# EAGLE design p2p-001 (EAGLE 9.6.2)
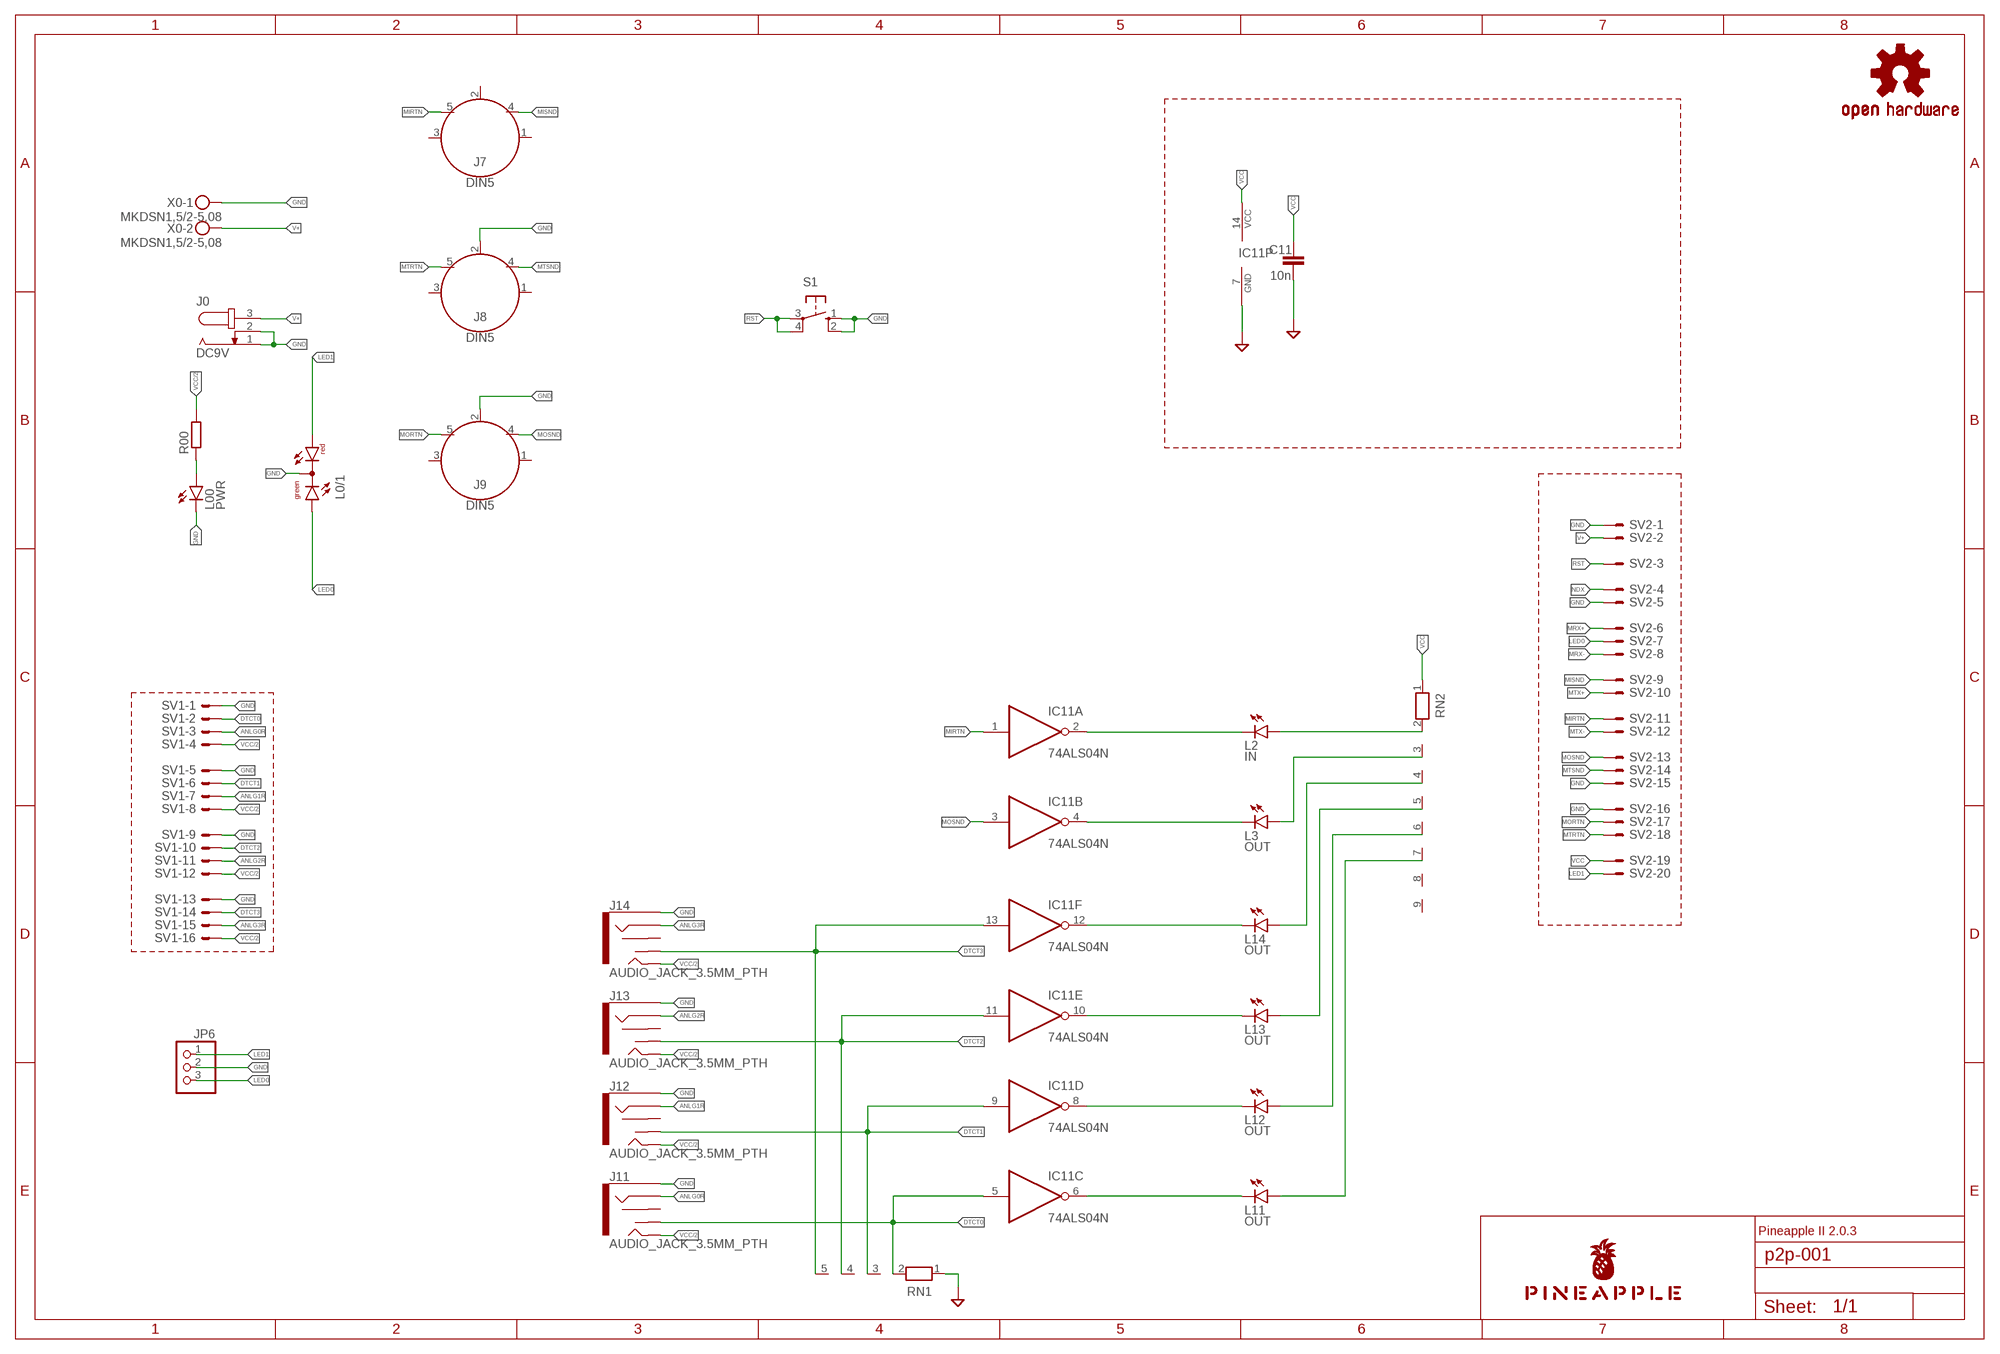
[diagram p0: schematic, sheet 1]

## Parts
C11  10n  C-EU025-024X044  [C025-024X044]
IC11  74ALS04N  [DIL14]
J0  DC9V  JACK-PLUG0  [SPC4077]
J7  DIN5  [DIN5-RA-PTH]
J8  DIN5  [DIN5-RA-PTH]
J9  DIN5  [DIN5-RA-PTH]
J11  AUDIO_JACK_3.5MM_PTH  [AUDIO-JACK]
J12  AUDIO_JACK_3.5MM_PTH  [AUDIO-JACK]
J13  AUDIO_JACK_3.5MM_PTH  [AUDIO-JACK]
J14  AUDIO_JACK_3.5MM_PTH  [AUDIO-JACK]
JP6  PINHD-1X3  [1X03]
L00  PWR  LED3MM  [LED3MM]
L0/1  DUOLED-RG-C  [DUOLED-C-5MM]
L2  IN  LED3MM  [LED3MM]
L3  OUT  LED3MM  [LED3MM]
L11  OUT  LED3MM  [LED3MM]
L12  OUT  LED3MM  [LED3MM]
L13  OUT  LED3MM  [LED3MM]
L14  OUT  LED3MM  [LED3MM]
LOGO1  OSHW-LOGOS-COPPER  [OSHW-LOGO-S_COPPER]
R00  R-EU_0204/5  [0204/5]
RN1  RN04  [RN-5]
RN2  RN08  [RN-9]
S1  10-XX  [B3F-10XX]
SV1  ML16LE  [ML16L]
SV2  ML20LE  [ML20L]
U$1  PINEAPPLE450_SILK  [PINEAPPLE450_SILK]
X0  MKDSN1,5/2-5,08  [MKDSN1,5/2-5,08]

## Nets
ANLG0R: J11.RING SV1.3
ANLG1R: J12.RING SV1.7
ANLG2R: J13.RING SV1.11
ANLG3R: J14.RING SV1.15
DTCT0: IC11.5(C:I) J11.TSH RN1.2 SV1.2
DTCT1: IC11.9(D:I) J12.TSH RN1.3 SV1.6
DTCT2: IC11.11(E:I) J13.TSH RN1.4 SV1.10
DTCT3: IC11.13(F:I) J14.TSH RN1.5 SV1.14
GND [gnd]: C11.2 IC11.7(P:GND) J0.1 J0.2 J8.2 J9.2 J11.SLEEVE J12.SLEEVE J13.SLEEVE J14.SLEEVE JP6.2 L00.K(C) L0/1.C RN1.1 S1.1(S) S1.2(S1) SV1.1 SV1.5 SV1.9 SV1.13 SV2.1 SV2.5 SV2.15 SV2.16 X0.1
LED0: JP6.3 L0/1.AX(AG) SV2.7
LED1: JP6.1 L0/1.AR SV2.20
LEDPWR: L00.A R00.1
MIRTN: IC11.1(A:I) J7.5 SV2.11
MISND: J7.4 SV2.9
MORTN: J9.5 SV2.17
MOSND: IC11.3(B:I) J9.4 SV2.13
MRX+: SV2.6
MRX-: SV2.8
MTRTN: J8.5 SV2.18
MTSND: J8.4 SV2.14
MTX+ [gnd]: SV2.10
MTX-: SV2.12
N$1: IC11.2(A:O) L2.K(C)
N$2: IC11.4(B:O) L3.K(C)
N$3: L2.A RN2.2
N$4: L3.A RN2.3
N$5: L14.A RN2.4
N$6: L13.A RN2.5
N$7: IC11.12(F:O) L14.K(C)
N$8: IC11.10(E:O) L13.K(C)
N$9: IC11.8(D:O) L12.K(C)
N$10: IC11.6(C:O) L11.K(C)
N$12: L12.A RN2.6
N$13: L11.A RN2.7
NDX: SV2.4
RST: S1.3(P) S1.4(P1) SV2.3
V+ [power]: J0.3 SV2.2 X0.2
VCC [power]: C11.1 IC11.14(P:VCC) RN2.1 SV2.19
VCC/2 [power]: J11.TIP J12.TIP J13.TIP J14.TIP R00.2 SV1.4 SV1.8 SV1.12 SV1.16
Unconnected: J7.1 J7.2 J7.3 J8.1 J8.3 J9.1 J9.3 J11.RSH J12.RSH J13.RSH J14.RSH RN2.8 RN2.9

## Notes on the sheet
- Pineapple II 2.0.3

## Library data of the parts
C11 = resistor:C-EU: CAPACITOR, European symbol
IC11 = 74xx-us:74*04: Hex INVERTER
J0 = con-jack:JACK-PLUG: DC POWER JACK Power Jack, DC, Right Angle, Through Hole, Rated 5A at 16VDC, PC Terminals Distributor: Farnell (www.Farnell.de) Drawing: 84N1161.pdf / 84N1162.pdf Manufacturer: SPC Technology (www.spctechnology.com) Type: SPC4077 / SPC 4078; OC_FARNELL: unknown; OC_NEWARK: unknown
J7-J9 = SparkFun-Connectors:DIN5: DIN5 Connector - Female Right Angle (frequently used as a MIDI Jack connector) This type of connector and cable is frequently used for transmitting midi data (musical instrument digital interface). It is what you usually see on a keyboard or set of electronic drums. Learn more here <https://en.wikipedia.org/wiki/MIDI>. For more information on the pinout and electrical specifications of MIDI communications, please see the following resource: https://www.midi.org/specifications/item/midi-din-electrical-specification Here is the connector we sell at SparkFun: MIDI Connector - Female Right Angle <https://www.sparkfun.com/products/9536> (PRT-09536) Datasheet <hhttp://www.sparkfun.com/datasheets/Prototyping/Connectors/MIDI-RA.pdf> It is used on this SparkFun product: SparkFun MIDI Shield <https://www.sparkfun.com/products/12898> (DEV-12898); PROD_ID: CONN-09481
J11-J14 = SparkFun-Connectors:AUDIO_JACK_3.5MM: Audio Jack 3.5mm variants of PTH and SMT stereo audio jack with bypass switches. SparkFun Products: SparkFun SparkPunk Sound Kit <[https://www.sparkfun.com/products/11177]> - PTH MP3 Trigger <https://www.sparkfun.com/products/13720> -3.5mm SMD SparkFun PicoBoard <https://www.sparkfun.com/products/11888>- 2.5mm SMD; PROD_ID: CONN-08774; SF_ID: PRT-08032
JP6 = pinhead:PINHD-1X3: PIN HEADER
L00 L2 L3 L11-L14 = led:LED: LED OSRAM: - CHIPLED LG R971, LG N971, LY N971, LG Q971, LY Q971, LO R971, LY R971 LH N974, LH R974 LS Q976, LO Q976, LY Q976 LO Q996 - Hyper CHIPLED LW Q18S LB Q993, LB Q99A, LB R99A - SideLED LS A670, LO A670, LY A670, LG A670, LP A670 LB A673, LV A673, LT A673, LW A673 LH A674 LY A675 LS A676, LA A676, LO A676, LY A676, LW A676 LS A679, LY A679, LG A679 - Hyper Micro SIDELED® LS Y876, LA Y876, LO Y876, LY Y876 LT Y87S - SmartLED LW L88C, LW L88S LB L89C, LB L89S, LG L890 LS L89K, LO L89K, LY L89K LS L896, LA L896, LO L896, LY L896 - TOPLED LS T670, LO T670, LY T670, LG T670, LP T670 LSG T670, LSP T670, LSY T670, LOP T670, LYG T670 LG T671, LOG T671, LSG T671 LB T673, LV T673, LT T673, LW T673 LH T674 LS T676, LA T676, LO T676, LY T676, LB T676, LH T676, LSB T676, LW T676 LB T67C, LV T67C, LT T67C, LS T67K, LO T67K, LY T67K, LW E67C LS E67B, LA E67B, LO E67B, LY E67B, LB E67C, LV E67C, LT E67C LW T67C LS T679, LY T679, LG T679 LS T770, LO T770, LY T770, LG T770, LP T770 LB T773, LV T773, LT T773, LW T773 LH T774 LS E675, LA E675, LY E675, LS T675 LS T776, LA T776, LO T776, LY T776, LB T776 LHGB T686 LT T68C, LB T68C - Hyper Mini TOPLED® LB M676 - Mini TOPLED Santana® LG M470 LS M47K, LO M47K, LY M47K Source: http://www.osram.convergy.de LUXEON: - LUMILED® LXK2-PW12-R00, LXK2-PW12-S00, LXK2-PW14-U00, LXK2-PW14-V00 LXK2-PM12-R00, LXK2-PM12-S00, LXK2-PM14-U00 LXK2-PE12-Q00, LXK2-PE12-R00, LXK2-PE12-S00, LXK2-PE14-T00, LXK2-PE14-U00 LXK2-PB12-K00, LXK2-PB12-L00, LXK2-PB12-M00, LXK2-PB14-N00, LXK2-PB14-P00, LXK2-PB14-Q00 LXK2-PR12-L00, LXK2-PR12-M00, LXK2-PR14-Q00, LXK2-PR14-R00 LXK2-PD12-Q00, LXK2-PD12-R00, LXK2-PD12-S00 LXK2-PH12-R00, LXK2-PH12-S00 LXK2-PL12-P00, LXK2-PL12-Q00, LXK2-PL12-R00 Source: www.luxeon.com KINGBRIGHT: KA-3528ASYC Source: www.kingbright.com
L0/1 = led:DUOLED-RG-C: DUO LED 2 colors (red/green), 5 mm, round, common Cathode www.ligitek.com or other producers.
LOGO1 = SparkFun-Aesthetics:OSHW-LOGO: Open-Source Hardware (OSHW) Logo This logo indicates the piece of hardware it is found on incorporates a OSHW license and/or adheres to the definition of open source hardware found here: http://freedomdefined.org/OSHW
R00 = rcl:R-EU_: RESISTOR, European symbol; SPICEPREFIX: R
RN1 = resistor-net:RN04: RESISTOR NETWORK; OC_FARNELL: unknown; OC_NEWARK: unknown
RN2 = resistor-net:RN08: RESISTOR NETWORK; OC_FARNELL: unknown; OC_NEWARK: unknown
S1 = switch-omron:10-XX: OMRON SWITCH; MPN: B3F-1000; OC_FARNELL: 176432; OC_NEWARK: 36M3542
SV1 = con-ml:ML16LE: HARTING; OC_FARNELL: unknown; OC_NEWARK: unknown
SV2 = con-ml:ML20LE: HARTING; OC_FARNELL: unknown; OC_NEWARK: unknown
U$1 = pineapple:PINEAPPLE450_SILK
X0 = con-phoenix-508:MKDSN1,5/2-5,08: MKDSN 1,5/ 2-5,08 Printklemme Nennstrom: 13,5 A Nennspannung: 250 V Rastermaß: 5,08 mm Polzahl: 2 Anschlussart: Schraubanschluss Montage: Löten Anschlussrichtung Leiter/Platine: 0 ° Artikelnummer: 1729128 Source: http://eshop.phoenixcontact.com .. 1729128.pdf

## Net classes
0 default: width 0.152 mm, drill 0.152 mm, clearance 0.152 mm
1 gnd: width 0.61 mm, drill 0.152 mm, clearance 0.152 mm
2 power: width 0.61 mm, drill 0.152 mm, clearance 0.152 mm
3 analog: width 0.305 mm, drill 0.152 mm, clearance 0.152 mm

## Board
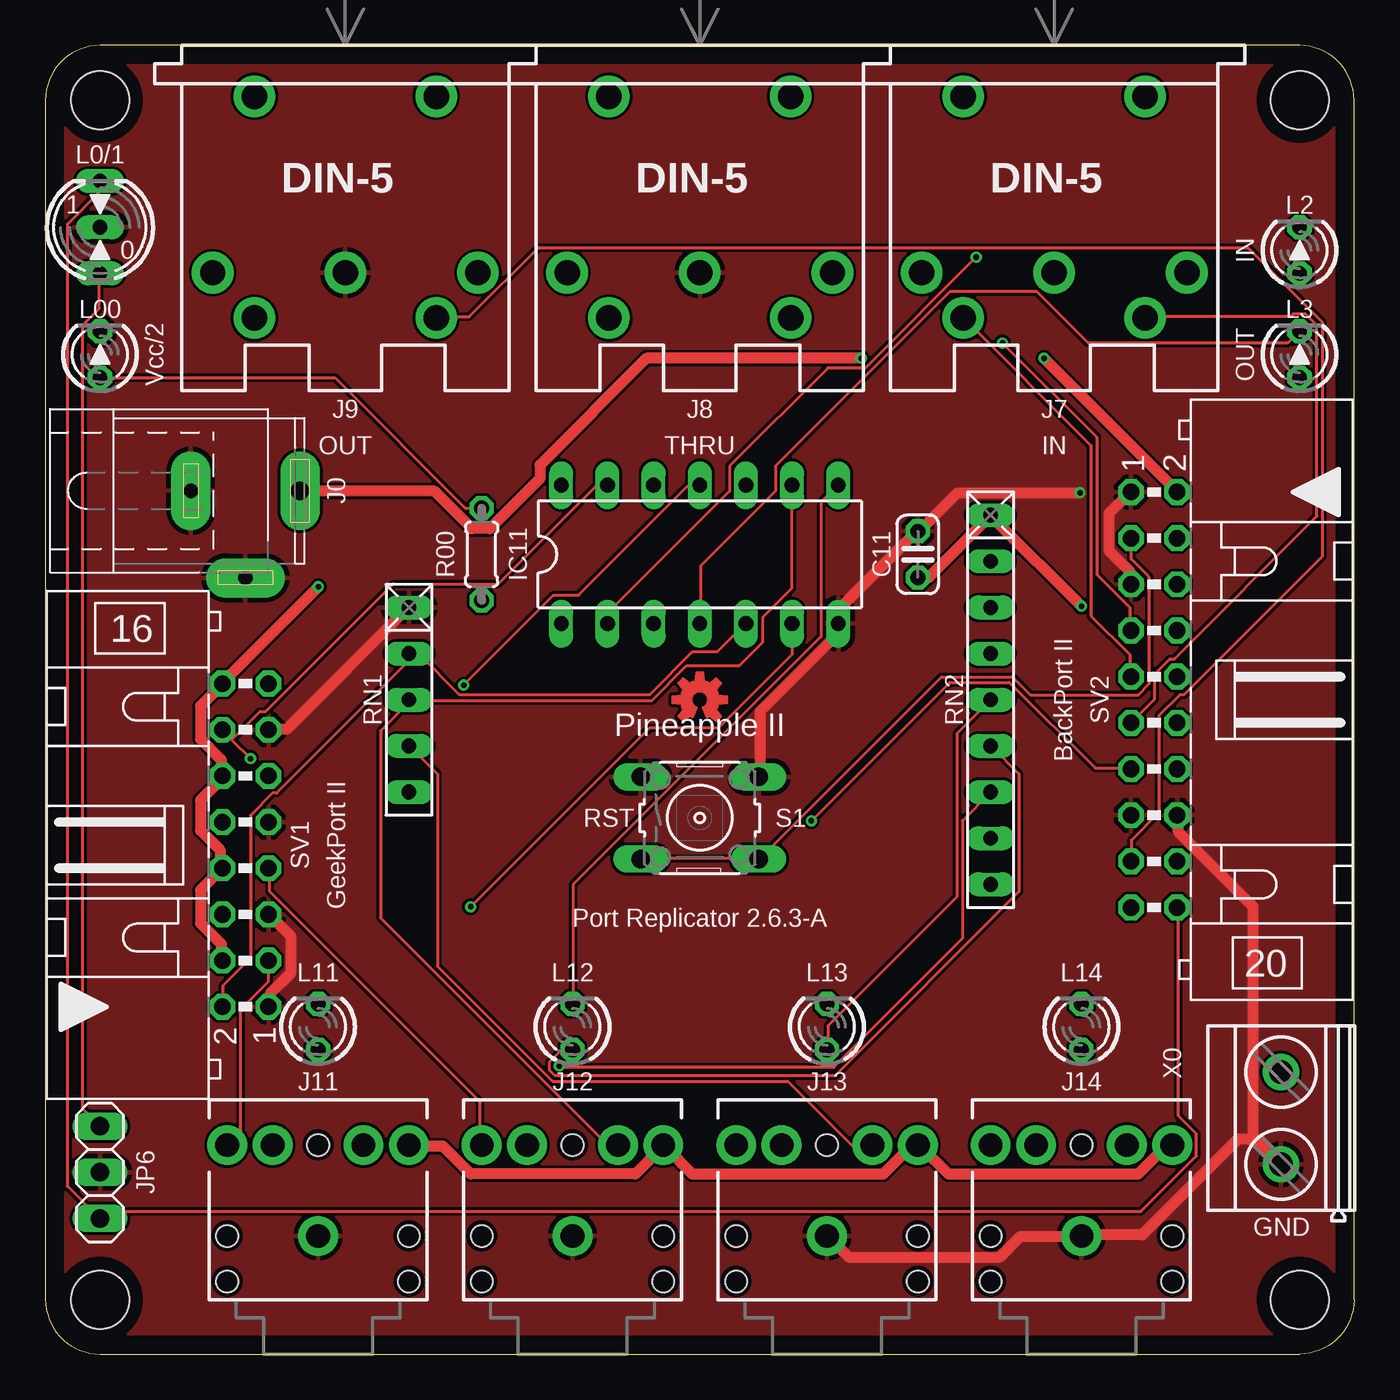
[diagram p1: board, top side]
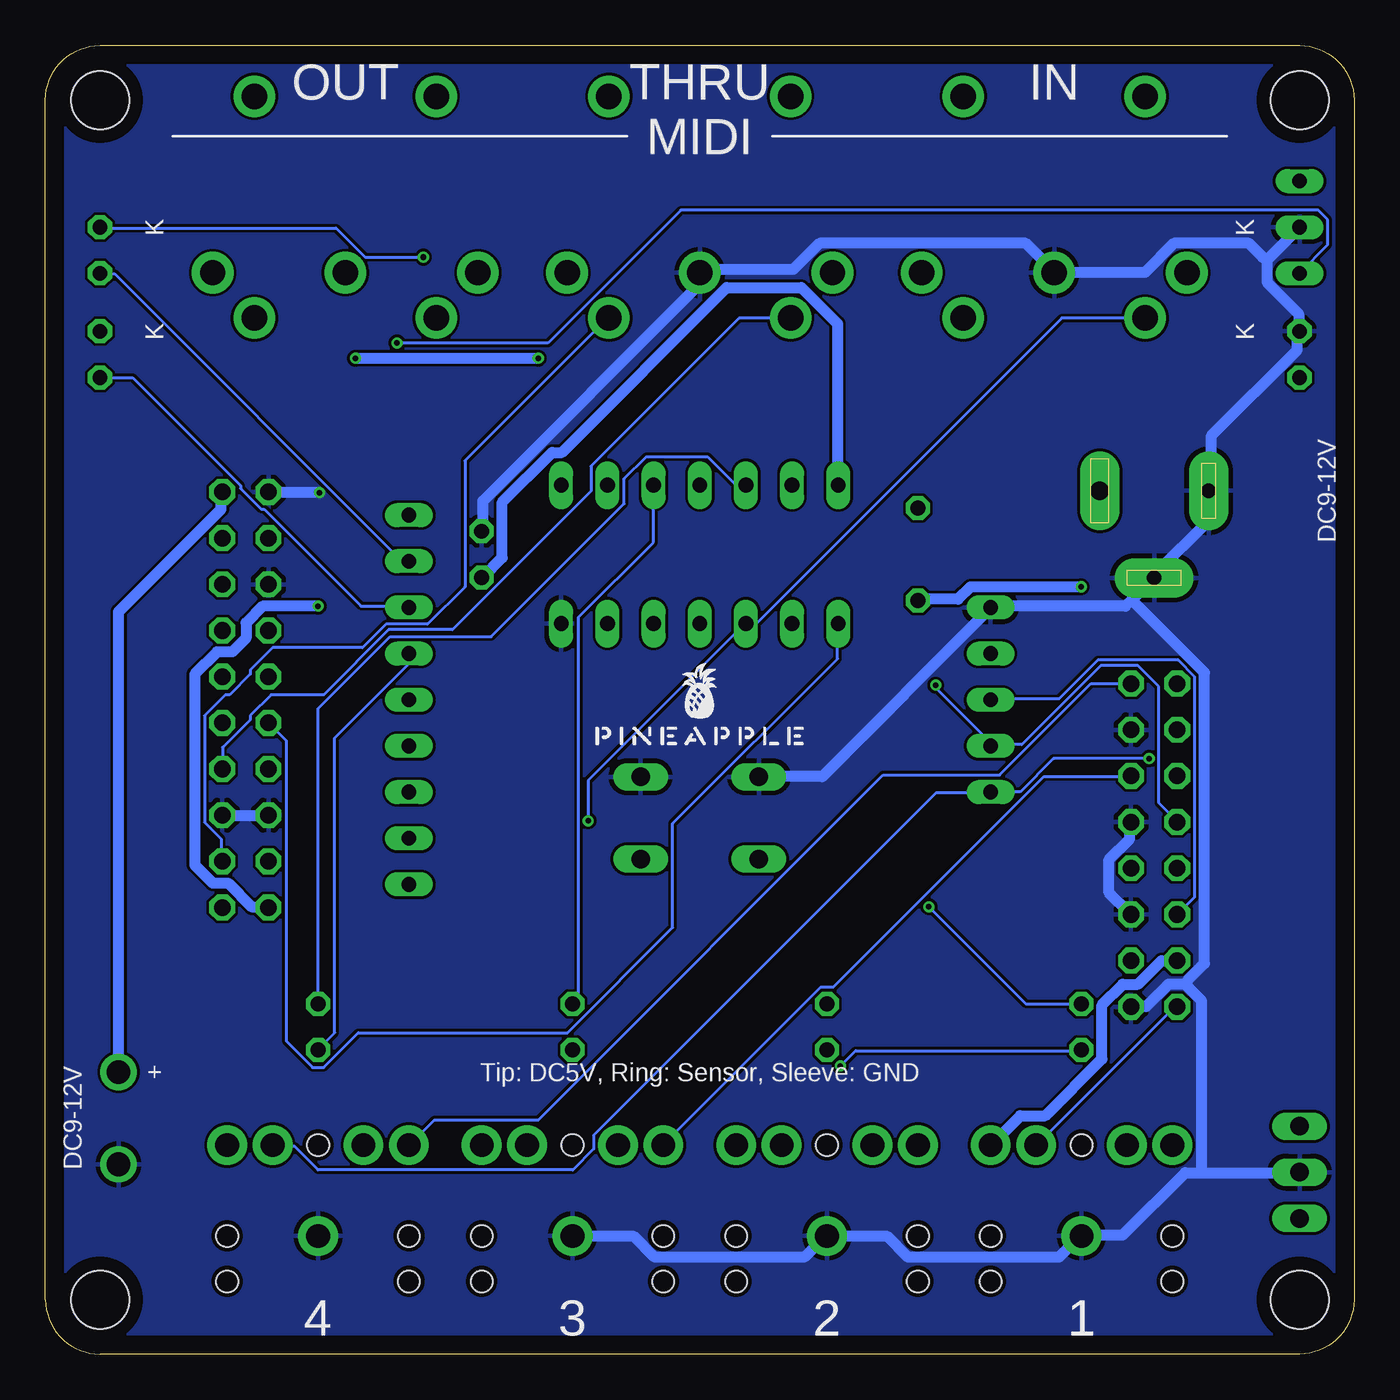
[diagram p2: board, bottom side, seen from below]

Size 72 x 72 mm. Coordinates in mm from the lower left corner, seen from the top.
Outline: 3,0 69,0 arc90 72,3 72,69 arc90 69,72 3,72 arc90 0,69 0,3 arc90 3,0
Copper layers (1*16): Top 0.035mm / dielectric 1.5mm / Bottom 0.035mm
Design rules "SeeedStudio_2layer_DRU_no_angle_20140221": minimum track width 6mil, minimum drill 12mil, track to track 6mil, track to pad 6mil, pad to pad 6mil, via to via 6mil, smd to smd 0mil, copper to edge 10mil, drill to drill 10mil, minimum pad ring 10mil, minimum via ring 6mil, stop-mask expansion 2mil, vias tented up to drill 100mil, thermal gap 10mil
Holes 3.2 mm at 3,3 69,3 69,69 3,69
tRestrict: area 0.8,66.8 to 5.2,71.2; area 66.8,66.8 to 71.2,71.2; area 0.8,0.8 to 5.2,5.2; area 66.8,0.8 to 71.2,5.2; area 0,71 to 72,72; area 0,0 to 72,1; area 0,0 to 1,72; area 71,0 to 72,72
bRestrict: area 0.8,0.8 to 5.2,5.2; area 66.8,0.8 to 71.2,5.2; area 66.8,66.8 to 71.2,71.2; area 0.8,66.8 to 5.2,71.2; area 0,71 to 72,72; area 0,0 to 72,1; area 0,0 to 1,72; area 71,0 to 72,72
vRestrict: area 30,33 to 42,38

### Footprints (pad centres in the part's own frame; a part is rotated, then mirrored left to right if it is on the bottom)
C025-024X044 = drill 0.813 octagon: 1 -1.27,0; 2 1.27,0
DIL14 = drill 0.813 long: 1 -7.62,-3.81; 2 -5.08,-3.81; 3 -2.54,-3.81; 4 0,-3.81; 5 2.54,-3.81; 6 5.08,-3.81; 7 7.62,-3.81; 8 7.62,3.81; 9 5.08,3.81; 10 2.54,3.81; 11 0,3.81; 12 -2.54,3.81; 13 -5.08,3.81; 14 -7.62,3.81
SPC4077 = drill 0.8 pad 2.184 long: 1 -3,0; 2 0,-4.8 | drill 1 pad 2.184 long: 3 3,0
DIN5-RA-PTH = drill 1.4 pad 2.286: 1 7.3,12.5; 2 0,12.5; 3 -7.3,12.5; 4 5,15; 5 -5,15; 6 -5,2.8; 7 5,2.8
AUDIO-JACK = drill 1.3 pad 2.184: RING 5,5; RSH 5,2.5; SLEEVE 0,0; TIP 5,-5; TSH 5,-2.5 | hole 1.2: 0,5; -2.5,5; -2.5,-5; 0,-5; 5,0
1X03 = drill 1.016 long: 1 -2.54,0; 2 0,0; 3 2.54,0
LED3MM = drill 0.813 octagon: A -1.27,0; K 1.27,0
DUOLED-C-5MM = drill 0.813 long: AR 2.54,0; AX -2.54,0; C 0,0
0204/5 = drill 0.813 octagon: 1 -2.54,0; 2 2.54,0
RN-5 = drill 0.813 long: 1 -5.08,0; 2 -2.54,0; 3 0,0; 4 2.54,0; 5 5.08,0
RN-9 = drill 0.813 long: 1 -10.16,0; 2 -7.62,0; 3 -5.08,0; 4 -2.54,0; 5 0,0; 6 2.54,0; 7 5.08,0; 8 7.62,0; 9 10.16,0
B3F-10XX = drill 1.016 long: 1 -3.251,2.261; 2 3.251,2.261; 3 -3.251,-2.261; 4 3.251,-2.261
ML16L = drill 0.914 octagon: 1 -8.89,-1.27; 2 -8.89,1.27; 3 -6.35,-1.27; 4 -6.35,1.27; 5 -3.81,-1.27; 6 -3.81,1.27; 7 -1.27,-1.27; 8 -1.27,1.27; 9 1.27,-1.27; 10 1.27,1.27; 11 3.81,-1.27; 12 3.81,1.27; 13 6.35,-1.27; 14 6.35,1.27; 15 8.89,-1.27; 16 8.89,1.27
ML20L = drill 0.914 octagon: 1 -11.43,-1.27; 2 -11.43,1.27; 3 -8.89,-1.27; 4 -8.89,1.27; 5 -6.35,-1.27; 6 -6.35,1.27; 7 -3.81,-1.27; 8 -3.81,1.27; 9 -1.27,-1.27; 10 -1.27,1.27; 11 1.27,-1.27; 12 1.27,1.27; 13 3.81,-1.27; 14 3.81,1.27; 15 6.35,-1.27; 16 6.35,1.27; 17 8.89,-1.27; 18 8.89,1.27; 19 11.43,-1.27; 20 11.43,1.27
MKDSN1,5/2-5,08 = drill 1.3 pad 2: 1 -2.561,0.025; 2 2.519,0.025

### Placement (x,y rotation side)
C11  48,44 90 top
IC11  36,44 0 top
J0  11,47.5 0 top
J7  55.5,72 180 top
J8  36,72 180 top
J9  16.5,72 180 top
J11  15,6.5 90 top
J12  29,6.5 90 top
J13  43,6.5 90 top
J14  57,6.5 90 top
JP6  3,10 90 top
L00  3,55 90 top
L0/1  3,62 90 top
L2  69,60.73 90 top
L3  69,55 90 top
L11  15,18 90 top
L12  29,18 90 top
L13  43,18 90 top
L14  57,18 90 top
LOGO1  36,36 0 top
R00  24,44 270 top
RN1  20,36 270 top
RN2  52,36 270 top
S1  36,29.5 0 top
SV1  11,28 90 top
SV2  61,36 270 top
U$1  36,33.5 0 bottom
X0  68,13 90 top

### Tracks (layer width: path | path; a pad name or v marks a point on that pad's centre or on a via)
ANLG0R
  Top 0.152: SV1.3 12.27,20.5 10.74,18.97 10.74,12.19 10.06,11.51 J11.RING
ANLG1R
  Top 0.152: SV1.7 12.34,26.67 12.34,25.45 23.93,13.87 23.93,11.51 J12.RING
ANLG2R
  Bottom 0.152: SV1.11 12.34,31.77 17.07,31.77 28.65,20.19 29.34,20.19 38.02,11.51 J13.RING
ANLG3R
  Bottom 0.152: SV1.15 12.34,36.88 14.48,36.88 19.51,31.85 25.91,31.85 44.88,12.88 50.6,12.88 51.97,11.51 J14.RING
DTCT0
  Top 0.152: IC11.5 38.48,40.16 36.96,38.63 35.59,38.63 33.22,36.27 22.78,36.27 20.57,38.48 20.04,38.48 RN1.2 20.04,38.41 20.04,38.18 12.72,30.86 12.5,30.86 11.28,29.64 11.28,21.79 9.75,20.27 9.75,19.13 SV1.2
  Bottom 0.152: SV1.2 9.75,19.05 9.91,19.05 17.45,11.51 J11.TSH
DTCT1
  Top 0.152: IC11.9 41.07,47.78 41.07,42.14 39.47,40.54 39.47,39.17 38.18,37.87 35.28,37.87 33.38,35.97 20.04,35.97 RN1.3 20.04,35.89 18.44,34.29 18.44,24 30.94,11.51 31.47,11.51 J12.TSH
  Bottom 0.152: RN1.3 19.96,36.04 16.23,36.04 14.1,38.18 9.68,38.18 8.76,37.26 8.76,25.15 9.68,24.23 SV1.6
DTCT2  (via drill 0.3)
  Top 0.152: v23.01,36.8 27.96,41.76 29.34,41.76 35.36,47.78 35.97,47.78 IC11.11 | J13.TSH 44.35,11.51 40.84,15.01 27.89,15.01 21.57,21.34 21.57,31.93 20.04,33.45 RN1.4
  Bottom 0.152: SV1.10 9.75,29.34 10.74,30.33 10.74,36.73 11.89,37.87 13.95,37.87 18.29,33.53 19.96,33.53 RN1.4 19.96,33.6 23.01,36.65 v23.01,36.8
DTCT3  (via drill 0.3)
  Top 0.152: 10.25,33.8 9.75,34.29 SV1.14 | 10.25,33.8 v11.28,32.77 | 10.25,33.8 11.81,35.36 12.12,35.36 19.13,42.37 24.92,42.37 30.33,47.78 30.86,47.78 IC11.13
  Bottom 0.152: v11.28,32.77 16.54,32.77 18.36,30.94 19.96,30.94 RN1.5 20.04,30.86 23.01,30.86 41.83,12.04 41.83,11.28 42.98,10.13 57,10.13 58.29,11.43 59.44,11.43 J14.TSH
GND  (via drill 0.3)
  Top 0.61: SV2.5 59.66,42.37 59.66,43.05 58.52,44.2 58.52,46.25 59.66,47.4 SV2.1 | S1.2 39.32,31.77 39.32,35.36 43.51,39.55 43.51,39.93 IC11.7 43.66,40.23 43.66,41 47.93,45.26 C11.2 48.23,45.41 50.22,47.4 v56.92,47.4 | SV1.13 12.34,34.37 13.26,34.37 19.96,41.07 RN1.1 | 66.45,11.96 66.45,24.61 62.33,28.73 62.33,29.64 SV2.16 | 66.45,11.96 X0.1 | 66.45,11.96 66.22,11.81 65.61,11.81 60.35,6.55 57.07,6.55 J14.SLEEVE 56.69,6.48 53.65,6.48 52.5,5.33 44.2,5.33 43.05,6.48 J13.SLEEVE | SV1.1 12.34,19.13 12.34,19.81 13.49,20.95 13.49,23.01 12.34,24.16 SV1.5
  Bottom 0.61: v56.92,47.4 59.66,47.4 SV2.1 | C11.2 47.93,45.34 47.93,46.94 36.04,58.83 36.04,59.44 J8.2 35.74,59.66 30.86,59.66 29.41,61.11 18.06,61.11 16.69,59.74 J9.2 16.46,59.51 11.51,59.51 9.91,61.11 5.79,61.11 5.03,60.35 4.8,60.2 | 4.8,60.2 4.8,58.98 3.05,57.23 3.05,56.31 L00.K 3.12,56.01 3.12,55.24 7.85,50.52 7.85,47.78 J0.1 8,47.47 8,45.87 10.9,42.98 J0.2 11.05,42.67 12.23,41.49 | 4.8,60.2 3.05,61.95 L0/1.C | 12.23,41.49 12.57,41.15 19.96,41.15 RN1.1 20.19,40.84 29.26,31.77 32.69,31.77 S1.1 | SV2.15 62.26,29.64 SV2.16 | SV1.9 12.34,29.26 12.34,28.35 13.49,27.2 13.49,25.38 12.34,24.23 SV1.5 | 8.38,9.98 9.3,9.98 12.72,6.55 14.94,6.55 J11.SLEEVE 15.24,6.33 16.23,5.33 24.54,5.33 25.68,6.48 28.96,6.48 J12.SLEEVE 29.26,6.33 30.25,5.33 38.48,5.33 39.62,6.48 42.98,6.48 J13.SLEEVE | 8.38,9.98 3.05,9.98 JP6.2 | 9.3,20.34 10.21,20.34 11.43,19.13 12.27,19.13 SV1.1 | 9.3,20.34 8.38,19.43 8.38,9.98 | 12.23,41.49 8.23,37.49 8.23,21.49 9.14,20.57 9.3,20.34
  pour Top: -1,-1 73,-1 73,73 -1,73
  pour Bottom: -2,-2 74,-2 74,74 -2,74
LED0  (via drill 0.3)
  Top 0.152: L0/1.AX 2.97,59.44 2.97,57.53 2.06,56.62 2.06,13.49 2.97,12.57 JP6.3 | v52.65,55.63 57.84,50.44 57.84,42.9 59.66,41.07 59.66,39.85 SV2.7
  Bottom 0.152: v52.65,55.63 44.35,55.63 37.03,62.94 1.98,62.94 1.45,62.41 1.45,61.04 2.97,59.51 L0/1.AX
LED1
  Top 0.152: L0/1.AR 2.97,64.47 2.97,63.93 1.22,62.18 1.22,9.22 2.97,7.47 JP6.1 3.05,7.47 3.43,7.85 60.27,7.85 63.32,10.9 63.32,12.12 62.33,13.11 62.33,24.54 SV2.20
LEDPWR
  Top 0.152: R00.1 23.93,46.56 23.09,46.56 15.93,53.72 3.05,53.72 L00.A
MIRTN
  Top 0.152: J7.5 60.5,57.07 68.5,57.07 68.66,57.23 69.34,57.23 69.95,56.62 69.95,46.1 62.1,38.25 61.87,38.25 61.04,37.41 61.04,36.04 59.74,34.75 SV2.11
  Bottom 0.152: IC11.1 28.42,40.16 28.42,38.25 37.49,29.18 37.49,23.47 43.28,17.68 54.79,17.68 56.69,15.77 57.3,15.77 58.75,17.22 58.75,33.76 59.66,34.67 SV2.11
MISND
  Top 0.152: SV2.9 59.66,37.34 59.66,38.48 57.53,40.62 57.53,49.99 50.52,57 J7.4
MORTN
  Top 0.152: SV2.17 59.74,27.13 59.74,28.27 61.27,29.79 61.27,35.13 62.41,36.27 62.64,36.27 70.26,43.89 70.26,56.77 66.14,60.88 27.13,60.88 23.32,57.07 21.57,57.07 J9.5
MOSND  (via drill 0.3)
  Top 0.152: v42.14,29.34 49.76,36.96 53.03,36.96 57.76,32.23 59.66,32.23 SV2.13
  Bottom 0.152: J9.4 16.08,57 32.84,40.23 33.45,40.23 IC11.3 33.53,40.16 42.14,31.55 v42.14,29.34
MTRTN
  Bottom 0.152: SV2.18 62.33,27.13 62.33,28.35 63.25,29.26 63.25,35.13 62.1,36.27 61.87,36.27 60.73,37.41 60.73,37.64 59.51,38.86 54.56,38.86 53.26,40.16 50.98,40.16 48.92,42.22 48.92,49.15 41.07,57 J8.5
MTSND
  Bottom 0.152: SV2.14 62.26,32.23 62.26,33.38 60.73,34.9 60.73,35.13 59.59,36.27 56.69,36.27 53.11,39.85 49.61,39.85 41.99,47.47 41.99,48.84 33.83,57 31.01,57 J8.4
N$1  (via drill 0.3)
  Top 0.152: v51.21,60.35 45.11,54.25 43.05,54.25 37.64,48.84 37.64,47.47 30.94,40.77 30.94,40.23 IC11.2
  Bottom 0.152: v51.21,60.35 54.41,60.35 56.01,61.95 68.96,61.95 L2.K
N$2
  Top 0.152: IC11.4 36.04,40.23 36.04,43.36 40.16,47.47 40.16,48.84 49.76,58.45 54.56,58.45 57.38,55.63 68.35,55.63 68.96,56.24 L3.K
N$3
  Bottom 0.152: RN2.2 52.05,43.66 52.43,43.66 68.2,59.44 68.96,59.44 L2.A
N$4
  Bottom 0.152: RN2.3 52.05,41.15 54.63,41.15 59.97,46.48 60.12,46.48 61.27,47.62 61.27,47.78 67.21,53.72 68.96,53.72 L3.A
N$5
  Bottom 0.152: RN2.4 52.05,38.48 52.05,37.95 56.08,33.91 56.08,17.68 57,16.76 L14.A
N$6
  Top 0.152: L13.A 43.05,16.76 43.05,18.06 50.14,25.15 50.14,34.14 51.97,35.97 RN2.5
N$7
  Bottom 0.152: IC11.12 33.53,47.85 34.06,47.85 35.59,49.38 38.94,49.38 40.16,48.16 40.16,46.79 47.47,39.47 53.03,39.47 57,35.51 L14.K
N$8
  Bottom 0.152: IC11.10 38.56,47.78 38.56,44.65 42.67,40.54 42.67,19.58 42.98,19.28 L13.K
N$9
  Top 0.152: L12.K 29.03,19.28 29.03,25.83 42.67,39.47 42.67,46.86 43.59,47.78 IC11.8
N$10  (via drill 0.3)
  Top 0.152: v23.39,24.61 33.22,34.44 37.03,34.44 41.07,38.48 41.07,40.16 IC11.6
  Bottom 0.152: v23.39,24.61 18.06,19.28 L11.K
N$12
  Top 0.152: L12.A 28.96,16.69 28.35,16.69 27.74,16.08 27.74,15.62 28.04,15.32 43.43,15.32 53.57,25.45 53.57,31.93 52.05,33.45 RN2.6
N$13  (via drill 0.3)
  Top 0.152: v28.27,15.85 28.57,15.85 28.65,15.77 43.36,15.77 50.44,22.86 50.44,29.34 51.97,30.86 RN2.7
  Bottom 0.152: v28.27,15.85 27.43,16.69 15.01,16.69 L11.A
RST
  Top 0.152: SV2.3 59.74,43.74 60.73,42.75 60.73,36.88 60.12,36.27 54.18,36.27 53.19,37.26 49.3,37.26 39.32,27.28 S1.4 39.24,27.28 32.77,27.28 S1.3
V+  (via drill 0.3)
  Top 0.61: v44.88,54.79 33.07,54.79 27.2,48.92 27.2,48.16 24.46,45.41 23.47,45.41 21.41,47.47 14.02,47.47 J0.3 | v54.94,54.79 62.26,47.47 SV2.2
  Bottom 0.61: SV2.2 62.33,47.4 62.33,46.48 67.97,40.84 67.97,15.54 X0.2 | v54.94,54.79 v44.88,54.79
VCC  (via drill 0.3)
  Top 0.61: C11.1 48.01,42.75 48.62,42.75 51.97,46.1 RN2.1 52.2,45.95 v57,41.15
  Bottom 0.61: IC11.14 28.42,47.85 28.42,56.69 30.4,58.67 34.52,58.67 43.59,49.61 44.12,49.61 46.86,46.86 46.86,43.81 47.93,42.75 C11.1 | v57,41.15 60.05,41.15 60.96,40.23 60.96,39.4 61.72,38.63 62.56,38.63 63.78,37.41 63.78,26.9 62.79,25.91 61.95,25.91 60.66,24.61 59.74,24.61 SV2.19
VCC/2  (via drill 0.3)
  Top 0.61: SV1.4 9.68,21.72 9.68,22.55 8.53,23.7 8.53,25.53 9.68,26.67 SV1.8 9.6,26.98 9.6,27.74 8.53,28.8 8.53,30.48 9.6,31.55 SV1.12 9.68,31.85 9.68,32.69 8.53,33.83 8.53,35.66 9.53,36.65 SV1.16 9.75,36.96 v15.01,42.22 | J11.TIP 20.04,11.43 21.87,11.43 23.39,9.91 32.46,9.91 33.98,11.43 J12.TIP 34.21,11.28 35.59,9.91 46.1,9.91 47.62,11.43 47.93,11.43 J13.TIP 48.23,11.35 49.68,9.91 60.12,9.91 61.65,11.43 61.95,11.43 J14.TIP
  Bottom 0.61: v15.01,42.22 21.11,42.22 21.79,41.53 23.93,41.53 R00.2 | SV1.4 9.75,21.64 10.59,21.64 11.89,20.34 12.72,20.34 13.87,19.2 13.87,16.23 16.99,13.11 18.36,13.11 19.96,11.51 J11.TIP

### Text on the board
tNames: 1 | 0 | IN | Vcc/2 | OUT | OUT | THRU | IN | BackPort II | Pineapple II | RST | GeekPort II | Port Replicator 2.6.3-A | GND
bNames: IN | THRU | OUT | MIDI | K | K | K | K | DC9-12V | + | Tip: DC5V, Ring: Sensor, Sleeve: GND | DC9-12V | 1 | 2 | 3 | 4